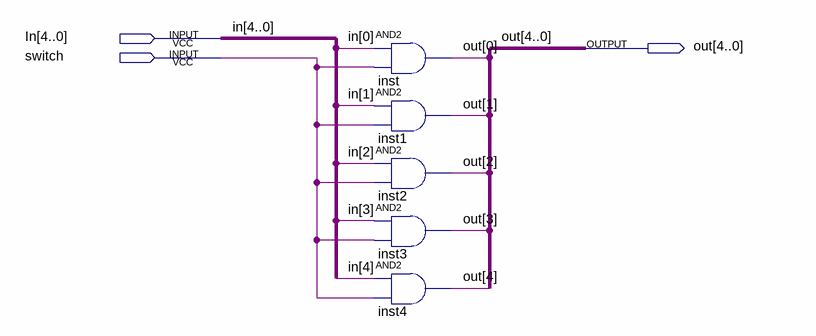
[diagram p0: schematic sheet]
// Quartus schematic 5bit_switch.bdf as structural Verilog: 5 symbols, 3 pins
module \5bit_switch  (
  input  [4:0] In,
  input  switch,
  output [4:0] out
);

  and inst (out[0], In[0], switch);
  and inst1 (out[1], In[1], switch);
  and inst2 (out[2], In[2], switch);
  and inst3 (out[3], In[3], switch);
  and inst4 (out[4], In[4], switch);
endmodule
